# Altium schematic sheet Sensors.SchDoc: Sensors
size A3; PageSetup: Record=PageOptions|CenterHorizontal=True|CenterVertical=True|PrintScale=1.00|XCorrection=1.00|YCorrection=1.00|PrintKind=1|BorderSize=5000000|LeftOffset=0|BottomOffset=0|Orientation=2|PaperLength=1000|PaperWidth=1000|Scale=100|PaperSource=7|PrintQuality=-3|MediaType=1|DitherType=10|PrintScaleMode=1|PaperKind=A3|PaperIndex=8; DocumentNumber: 5; SheetNumber: 5; SheetTotal: 6
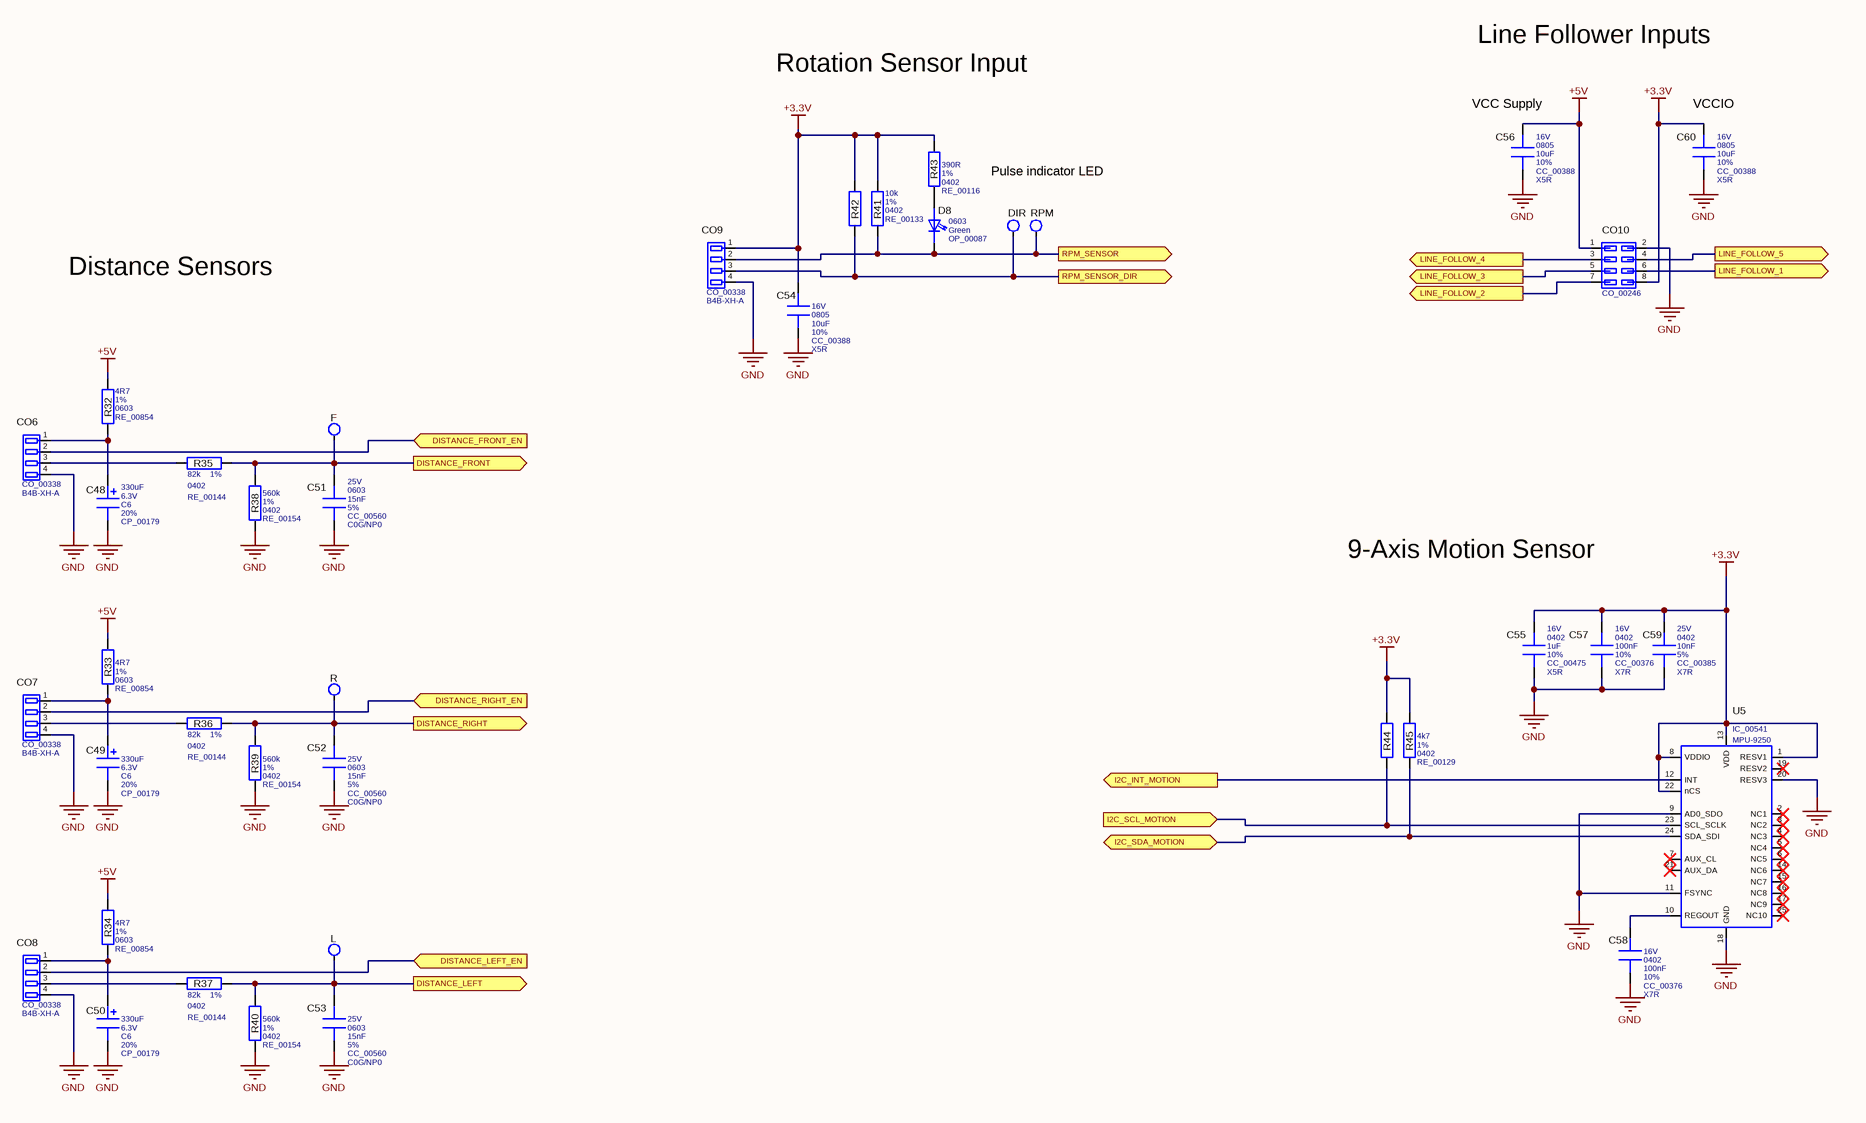
[diagram p0: Sensors.SchDoc]

## Parts
C48  Capacitance: 330uF  Voltage: 6.3V  Package: C6  Tolerance: 20%  Part_Number: CP_00179  [CP_00179L]  (hidden comment: capacitor_polar)
C49  Capacitance: 330uF  Voltage: 6.3V  Package: C6  Tolerance: 20%  Part_Number: CP_00179  [CP_00179L]  (hidden comment: capacitor_polar)
C50  Capacitance: 330uF  Voltage: 6.3V  Package: C6  Tolerance: 20%  Part_Number: CP_00179  [CP_00179L]  (hidden comment: capacitor_polar)
C51  Voltage: 25V  Package: 0603  Capacitance: 15nF  Tolerance: 5%  Part_Number: CC_00560  Dielectric_Material: C0G/NP0  [CS1600X800X900X350X1250L]  (hidden comment: capacitor)
C52  Voltage: 25V  Package: 0603  Capacitance: 15nF  Tolerance: 5%  Part_Number: CC_00560  Dielectric_Material: C0G/NP0  [CS1600X800X900X350X1250L]  (hidden comment: capacitor)
C53  Voltage: 25V  Package: 0603  Capacitance: 15nF  Tolerance: 5%  Part_Number: CC_00560  Dielectric_Material: C0G/NP0  [CS1600X800X900X350X1250L]  (hidden comment: capacitor)
C54  Voltage: 16V  Package: 0805  Capacitance: 10uF  Tolerance: 10%  Part_Number: CC_00388  Dielectric_Material: X5R  [CS2000x1250x1250x350x1650L]  (hidden comment: capacitor)
C55  Voltage: 16V  Package: 0402  Capacitance: 1uF  Tolerance: 10%  Part_Number: CC_00475  Dielectric_Material: X5R  [CS1000X500X560X250X820L]  (hidden comment: capacitor)
C56  Voltage: 16V  Package: 0805  Capacitance: 10uF  Tolerance: 10%  Part_Number: CC_00388  Dielectric_Material: X5R  [CS2000x1250x1250x350x1650L]  (hidden comment: capacitor)
C57  Voltage: 16V  Package: 0402  Capacitance: 100nF  Tolerance: 10%  Part_Number: CC_00376  Dielectric_Material: X7R  [CS1000X500X560X250X820L]  (hidden comment: capacitor)
C58  Voltage: 16V  Package: 0402  Capacitance: 100nF  Tolerance: 10%  Part_Number: CC_00376  Dielectric_Material: X7R  [CS1000X500X560X250X820L]  (hidden comment: capacitor)
C59  Voltage: 25V  Package: 0402  Capacitance: 10nF  Tolerance: 5%  Part_Number: CC_00385  Dielectric_Material: X7R  [CS1000X500X560X250X820L]  (hidden comment: capacitor)
C60  Voltage: 16V  Package: 0805  Capacitance: 10uF  Tolerance: 10%  Part_Number: CC_00388  Dielectric_Material: X5R  [CS2000x1250x1250x350x1650L]  (hidden comment: capacitor)
CO6  Part_Number: CO_00338  Manufacturer_Number: B4B-XH-A  [CO_00338N]  (hidden comment: header1x4)
CO7  Part_Number: CO_00338  Manufacturer_Number: B4B-XH-A  [CO_00338N]  (hidden comment: header1x4)
CO8  Part_Number: CO_00338  Manufacturer_Number: B4B-XH-A  [CO_00338N]  (hidden comment: header1x4)
CO9  Part_Number: CO_00338  Manufacturer_Number: B4B-XH-A  [CO_00338N]  (hidden comment: header1x4)
CO10  Part_Number: CO_00246  [CO_00246N]  (hidden comment: header2x4)
D8  Package: 0603  Color: Green  Part_Number: OP_00087  [OP_00087L]  (hidden comment: LED)
DIR  testpoint  [CO_00057N]  (value not drawn)  (no BOM)
F  testpoint  [CO_00057N]  (value not drawn)  (no BOM)
L  testpoint  [CO_00057N]  (value not drawn)  (no BOM)
R  testpoint  [CO_00057N]  (value not drawn)  (no BOM)
R32  Resistance: 4R7  Tolerance: 1%  Package: 0603  Part_Number: RE_00854  [RS1600X850X450X300X1300L]  (hidden comment: Resistor)
R33  Resistance: 4R7  Tolerance: 1%  Package: 0603  Part_Number: RE_00854  [RS1600X850X450X300X1300L]  (hidden comment: Resistor)
R34  Resistance: 4R7  Tolerance: 1%  Package: 0603  Part_Number: RE_00854  [RS1600X850X450X300X1300L]  (hidden comment: Resistor)
R35  Resistance: 82k  Tolerance: 1%  Package: 0402  Part_Number: RE_00144  [RS1000X500X560X250X820L]  (hidden comment: Resistor)
R36  Resistance: 82k  Tolerance: 1%  Package: 0402  Part_Number: RE_00144  [RS1000X500X560X250X820L]  (hidden comment: Resistor)
R37  Resistance: 82k  Tolerance: 1%  Package: 0402  Part_Number: RE_00144  [RS1000X500X560X250X820L]  (hidden comment: Resistor)
R38  Resistance: 560k  Tolerance: 1%  Package: 0402  Part_Number: RE_00154  [RS1000X500X560X250X820L]  (hidden comment: Resistor)
R39  Resistance: 560k  Tolerance: 1%  Package: 0402  Part_Number: RE_00154  [RS1000X500X560X250X820L]  (hidden comment: Resistor)
R40  Resistance: 560k  Tolerance: 1%  Package: 0402  Part_Number: RE_00154  [RS1000X500X560X250X820L]  (hidden comment: Resistor)
R41  Resistance: 10k  Tolerance: 1%  Package: 0402  Part_Number: RE_00133  [RS1000X500X560X250X820L]  (hidden comment: Resistor)
R42  Resistor  [RS1000X500X560X250X820L]  (value not drawn)
R43  Resistance: 390R  Tolerance: 1%  Package: 0402  Part_Number: RE_00116  [RS1000X500X560X250X820L]  (hidden comment: Resistor)
R44  Resistor  [RS1000X500X560X250X820L]  (value not drawn)
R45  Resistance: 4k7  Tolerance: 1%  Package: 0402  Part_Number: RE_00129  [RS1000X500X560X250X820L]  (hidden comment: Resistor)
RPM  testpoint  [CO_00057N]  (value not drawn)  (no BOM)
U5  Manufacturer_Number: MPU-9250  [IC_00541N]  (hidden comment: IC_00541)

## Ports
DISTANCE_FRONT (out), DISTANCE_FRONT_EN (in), DISTANCE_LEFT (out), DISTANCE_LEFT_EN (in), DISTANCE_RIGHT (out), DISTANCE_RIGHT_EN (in), I2C_INT_MOTION (out), I2C_SCL_MOTION (in), I2C_SDA_MOTION (bidir), LINE_FOLLOW_1 (out), LINE_FOLLOW_2 (out), LINE_FOLLOW_3 (out), LINE_FOLLOW_4 (out), LINE_FOLLOW_5 (out), RPM_SENSOR (out), RPM_SENSOR_DIR (out)

## Nets
+3.3V: C54.2(PIN2) C55.2(PIN2) C57.2(PIN2) C59.2(PIN2) C60.2(PIN2) CO9.1(PIN1) CO10.8(PIN8) R41.2(PIN2) R42.2(PIN2) R43.2(PIN2) R44.2(PIN2) R45.2(PIN2) U5.1(RESV1) U5.8(VDDIO) U5.13(VDD) U5.22(nCS)
+5V: C56.2(PIN2) CO10.1(PIN1) R32.2(PIN2) R33.2(PIN2) R34.2(PIN2)
GND: C48.2(PIN2) C49.2(PIN2) C50.2(PIN2) C51.1(PIN1) C52.1(PIN1) C53.1(PIN1) C54.1(PIN1) C55.1(PIN1) C56.1(PIN1) C57.1(PIN1) C58.1(PIN1) C59.1(PIN1) C60.1(PIN1) CO6.4(PIN4) CO7.4(PIN4) CO8.4(PIN4) CO9.4(PIN4) CO10.2(PIN2) R38.1(PIN1) R39.1(PIN1) R40.1(PIN1) U5.9(AD0_SDO) U5.11(FSYNC) U5.18(GND) U5.20(RESV3)
DISTANCE_FRONT: C51.2(PIN2) F.1(PIN1) R35.2(PIN2) R38.2(PIN2) ; port DISTANCE_FRONT
DISTANCE_FRONT_EN: CO6.2(PIN2) ; port DISTANCE_FRONT_EN
DISTANCE_LEFT: C53.2(PIN2) L.1(PIN1) R37.2(PIN2) R40.2(PIN2) ; port DISTANCE_LEFT
DISTANCE_LEFT_EN: CO8.2(PIN2) ; port DISTANCE_LEFT_EN
DISTANCE_RIGHT: C52.2(PIN2) R.1(PIN1) R36.2(PIN2) R39.2(PIN2) ; port DISTANCE_RIGHT
DISTANCE_RIGHT_EN: CO7.2(PIN2) ; port DISTANCE_RIGHT_EN
I2C_INT_MOTION: U5.12(INT) ; port I2C_INT_MOTION
I2C_SCL_MOTION: R44.1(PIN1) U5.23(SCL_SCLK) ; port I2C_SCL_MOTION
I2C_SDA_MOTION: R45.1(PIN1) U5.24(SDA_SDI) ; port I2C_SDA_MOTION
LINE_FOLLOW_1: CO10.6(PIN6) ; port LINE_FOLLOW_1
LINE_FOLLOW_2: CO10.7(PIN7) ; port LINE_FOLLOW_2
LINE_FOLLOW_3: CO10.5(PIN5) ; port LINE_FOLLOW_3
LINE_FOLLOW_4: CO10.3(PIN3) ; port LINE_FOLLOW_4
LINE_FOLLOW_5: CO10.4(PIN4) ; port LINE_FOLLOW_5
RPM_SENSOR: CO9.2(PIN2) D8.1(CATHODE) R41.1(PIN1) RPM.1(PIN1) ; port RPM_SENSOR
RPM_SENSOR_DIR: CO9.3(PIN3) DIR.1(PIN1) R42.1(PIN1) ; port RPM_SENSOR_DIR
NetC48_1: C48.1(PIN1) CO6.1(PIN1) R32.1(PIN1)
NetC49_1: C49.1(PIN1) CO7.1(PIN1) R33.1(PIN1)
NetC50_1: C50.1(PIN1) CO8.1(PIN1) R34.1(PIN1)
NetC58_2: C58.2(PIN2) U5.10(REGOUT)
NetCO6_3: CO6.3(PIN3) R35.1(PIN1)
NetCO7_3: CO7.3(PIN3) R36.1(PIN1)
NetCO8_3: CO8.3(PIN3) R37.1(PIN1)
NetD8_2: D8.2(ANODE) R43.1(PIN1)

Not connected (* = marked no-connect by the designer): U5 2(NC1)* 3(NC2)* 4(NC3)* 5(NC4)* 6(NC5)* 7(AUX_CL)* 14(NC6)* 15(NC7)* 16(NC8)* 17(NC9)* 19(RESV2)* 21(AUX_DA)* 25(NC10)*

## Notes on the sheet
- Line Follower Inputs
- Rotation Sensor Input
- (near C56) VCC Supply
- (near C60) VCCIO
- Pulse indicator LED
- Distance Sensors
- 9-Axis Motion Sensor
- Size
- A3
- Rev
- Sheet
- of
- Date changed
- FH  JOANNEUM
- University of Applied Sciences
- Drawn by
- Title
- Check by

## Library data of the parts
C48-C50 = CP_00179: Manufacturer_Number: 875105144010; ESR: 0R02; Dielectric_Material: Conductive Polymer Aluminum Solid; Creator: Krenn Markus; Creation_Date: 13.06.2016; Datasheet_Link: http://ibi/dxdb_partdatasheet_download.php?pid=3183
C51-C53 = CC_00560: Part_Type: Fixed capacitors; Manufacturer_Number: C0603C153J3GACTU; Maximum_Capacitance: 0; Creator: Krenn Markus; Minimum_Capacitance: 0; Nominal_Voltage: 0; Creation_Date: 13.06.2016; Datasheet_Link: http://ibi/dxdb_partdatasheet_download.php?pid=3182
C54 C56 C60 = CC_00388: Part_Type: Fixed capacitors; Manufacturer_Number: GRM21BR61C106KE15L; Maximum_Capacitance: 0; Creator: Krenn Markus; Minimum_Capacitance: 0; Nominal_Voltage: 0; Creation_Date: 09.07.2012; Datasheet_Link: http://ibi/dxdb_partdatasheet_download.php?pid=388
C55 = CC_00475: Part_Type: Fixed capacitors; Manufacturer_Number: C1005X5R1C105K050BC; Maximum_Capacitance: 0; Creator: Krenn Markus; Minimum_Capacitance: 0; Nominal_Voltage: 0; Creation_Date: 29.01.2014; Datasheet_Link: http://ibi/dxdb_partdatasheet_download.php?pid=2355
C57 C58 = CC_00376: Part_Type: Fixed capacitors; Manufacturer_Number: GRM155R71C104KA88D; Maximum_Capacitance: 0; Creator: Okorn Robert; Minimum_Capacitance: 0; Nominal_Voltage: 0; Creation_Date: 09.07.2012; Datasheet_Link: http://ibi/dxdb_partdatasheet_download.php?pid=376
C59 = CC_00385: Part_Type: Fixed capacitors; Manufacturer_Number: C0402C103J3RACTU; Maximum_Capacitance: 0; Creator: Neissl Gernot; Minimum_Capacitance: 0; Nominal_Voltage: 0; Creation_Date: 09.07.2012; Datasheet_Link: http://ibi/dxdb_partdatasheet_download.php?pid=385
CO6-CO9 = CO_00338: XH connector - Disconnectable Crimp style connectors; Current: 3A; Impedance: 0R01; Power: 0W; Connector_Type: Pin-Header; Function_type: Wire-to-Board; Connector_gender: male; Pitch_style: 0.0025m; Mounting_angle: 0°; Contact_Count: 4; Row_Count: 1; Contact_coating: Tin; Nominal_AC_Voltage: 250VAC; Nominal_DC_Voltage: 250VDC; Mounting: Through Hole; Material: Copper-Alloy; Creator: Krenn Markus; Creation_Date: 15.06.2016; Datasheet_Link: http://ibi/dxdb_partdatasheet_download.php?pid=3185
CO10 = CO_00246: SMT .025" SQ POST HEADER; Manufacturer_Number: TSM-104-01-T-DV; Current: 6A; Impedance: 0R; Power: 0W; Connector_Type: Pin-Header; Function_type: Board-to-Board; Connector_gender: male; Pitch_style: 0.00254m; Mounting_angle: 0°; Contact_Count: 8; Row_Count: 2; Contact_coating: Tin; Nominal_AC_Voltage: 475VAC; Nominal_DC_Voltage: 475VDC; Mounting: SMD; Material: Phosphor-Bronze; Creator: Krenn Markus; Creation_Date: 30.01.2014; Datasheet_Link: http://ibi/dxdb_partdatasheet_download.php?pid=2391
D8 = OP_00087: Manufacturer_Number: TLMG1100-GS08; Type: Standard; Isolating_voltage: 0; Creator: Krenn Markus; Part_Type: LED; Transistor_type: 0; Creation_Date: 23.05.2016; Datasheet_Link: http://ibi/dxdb_partdatasheet_download.php?pid=3140
DIR F L R RPM = CO_00057: Testpoint 1.6mm Bohrung 1mm; Current: 0A; Impedance: 0R; Nominal_AC_Voltage: 0VAC; Nominal_DC_Voltage: 0VDC; Power: 0W; Part_Number: CO_00057; Manufacturer_Number: Testpoint; Connector_Type: Testpoint; Creator: Sirnik Heimo; Creation_Date: 09.07.2012; Datasheet_Link: http://ibi/dxdb_partdatasheet_download.php?pid=485
R32-R34 = RE_00854: Manufacturer_Number: MCWR06W4R70FTL; Part_Type: Fixed Resistors; Maximum_Resistance: 0; Nominal_voltage: 50V; Type: 0; Nominal_DC_Voltage: 0; Impact_current: 0; Creator: Krenn Markus; Creation_Date: 25.04.2017; Datasheet_Link: http://ibi/dxdb_partdatasheet_download.php?pid=3543
R35-R37 = RE_00144: Manufacturer_Number: MC00625W0402182K; Part_Type: Fixed Resistors; Maximum_Resistance: 0; Nominal_voltage: 50V; Type: 0; Creator: Krenn Markus; Nominal_DC_Voltage: 0; Impact_current: 0; Creation_Date: 09.07.2012; Datasheet_Link: http://ibi/dxdb_partdatasheet_download.php?pid=1549
R38-R40 = RE_00154: Manufacturer_Number: MC00625W04021560K; Part_Type: Fixed Resistors; Maximum_Resistance: 0; Nominal_voltage: 50V; Type: 0; Nominal_DC_Voltage: 0; Impact_current: 0; Creator: Krenn Markus; Creation_Date: 09.07.2012; Datasheet_Link: http://ibi/dxdb_partdatasheet_download.php?pid=1559
R41 = RE_00133: Manufacturer_Number: MC00625W0402110K; Part_Type: Fixed Resistors; Maximum_Resistance: 0; Nominal_voltage: 50V; Type: 0; Creator: Krenn Markus; Nominal_DC_Voltage: 0; Impact_current: 0; Creation_Date: 09.07.2012; Datasheet_Link: http://ibi/dxdb_partdatasheet_download.php?pid=1538
R42 = RE_00133: Manufacturer_Number: MC00625W0402110K; Part_Type: Fixed Resistors; Resistance: 10k; Tolerance: 1%; Maximum_Resistance: 0; Nominal_voltage: 50V; Package: 0402; Type: 0; Creator: Krenn Markus; Part_Number: RE_00133; Nominal_DC_Voltage: 0; Impact_current: 0; Creation_Date: 09.07.2012; Datasheet_Link: http://ibi/dxdb_partdatasheet_download.php?pid=1538
R43 = RE_00116: Manufacturer_Number: MC00625W04021390R; Part_Type: Fixed Resistors; Maximum_Resistance: 0; Nominal_voltage: 50V; Type: 0; Creator: Krenn Markus; Nominal_DC_Voltage: 0; Impact_current: 0; Creation_Date: 09.07.2012; Datasheet_Link: http://ibi/dxdb_partdatasheet_download.php?pid=1521
R44 = RE_00129: Manufacturer_Number: MC00625W040214K7; Part_Type: Fixed Resistors; Resistance: 4k7; Tolerance: 1%; Maximum_Resistance: 0; Nominal_voltage: 50V; Package: 0402; Type: 0; Creator: Krenn Markus; Part_Number: RE_00129; Nominal_DC_Voltage: 0; Impact_current: 0; Creation_Date: 09.07.2012; Datasheet_Link: http://ibi/dxdb_partdatasheet_download.php?pid=1534
R45 = RE_00129: Manufacturer_Number: MC00625W040214K7; Part_Type: Fixed Resistors; Maximum_Resistance: 0; Nominal_voltage: 50V; Type: 0; Creator: Krenn Markus; Nominal_DC_Voltage: 0; Impact_current: 0; Creation_Date: 09.07.2012; Datasheet_Link: http://ibi/dxdb_partdatasheet_download.php?pid=1534
U5 = IC_00541: MPU-9250 - GYRO/ACCEL/COMPASS, 9ACHSEN, I2C, QFN-24; Part_Type: Miscellaneous ICs; Creator: Sirnik Heimo; Part_Number: IC_00541; Creation_Date: 07.01.2015; Datasheet_Link: http://ibi/dxdb_partdatasheet_download.php?pid=2797